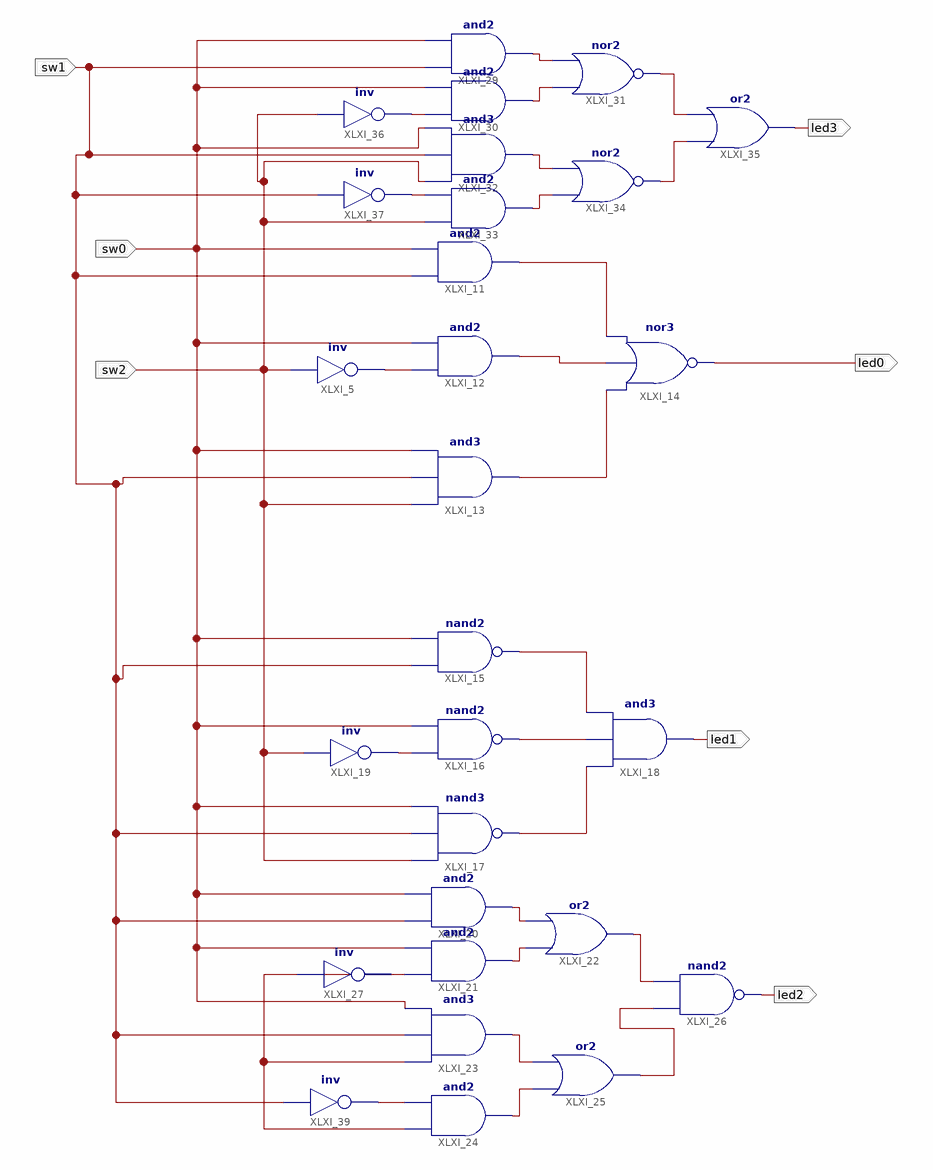
[diagram p0: schematic sheet 1]
// Xilinx ISE schematic lab24c.sch (artix7) as structural Verilog: 28 symbols, 7 ports
module lab24c (
  input  sw0,
  input  sw2,
  input  sw1,
  output led0,
  output led1,
  output led2,
  output led3
);

  wire XLXN_1, XLXN_2, XLXN_3, XLXN_5, XLXN_14, XLXN_15, XLXN_16, XLXN_24, XLXN_27, XLXN_28, XLXN_29,
       XLXN_30, XLXN_31, XLXN_32, XLXN_41, XLXN_43, XLXN_44, XLXN_46, XLXN_47, XLXN_48, XLXN_49, XLXN_50,
       XLXN_51, XLXN_74;

  not XLXI_5 (XLXN_5, sw2);
  and XLXI_11 (XLXN_1, sw1, sw0);
  and XLXI_12 (XLXN_2, XLXN_5, sw0);
  and XLXI_13 (XLXN_3, sw2, sw1, sw0);
  nor XLXI_14 (led0, XLXN_3, XLXN_2, XLXN_1);
  nand XLXI_15 (XLXN_14, sw1, sw0);
  nand XLXI_16 (XLXN_15, XLXN_24, sw0);
  nand XLXI_17 (XLXN_16, sw2, sw1, sw0);
  and XLXI_18 (led1, XLXN_16, XLXN_15, XLXN_14);
  not XLXI_19 (XLXN_24, sw2);
  and XLXI_20 (XLXN_27, sw1, sw0);
  and XLXI_21 (XLXN_28, XLXN_41, sw0);
  or XLXI_22 (XLXN_32, XLXN_28, XLXN_27);
  and XLXI_23 (XLXN_29, XLXN_41, sw1, sw0);
  and XLXI_24 (XLXN_30, XLXN_41, XLXN_74);
  or XLXI_25 (XLXN_31, XLXN_30, XLXN_29);
  nand XLXI_26 (led2, XLXN_31, XLXN_32);
  not XLXI_27 (XLXN_41, XLXN_41);
  and XLXI_29 (XLXN_43, sw1, sw0);
  and XLXI_30 (XLXN_44, XLXN_51, sw0);
  nor XLXI_31 (XLXN_46, XLXN_44, XLXN_43);
  and XLXI_32 (XLXN_48, sw2, sw1, sw0);
  and XLXI_33 (XLXN_49, sw2, XLXN_50);
  nor XLXI_34 (XLXN_47, XLXN_49, XLXN_48);
  or XLXI_35 (led3, XLXN_47, XLXN_46);
  not XLXI_36 (XLXN_51, sw2);
  not XLXI_37 (XLXN_50, sw1);
  not XLXI_39 (XLXN_74, sw1);
endmodule
